# EAGLE schematic knappekrets (EAGLE 9.6.2)
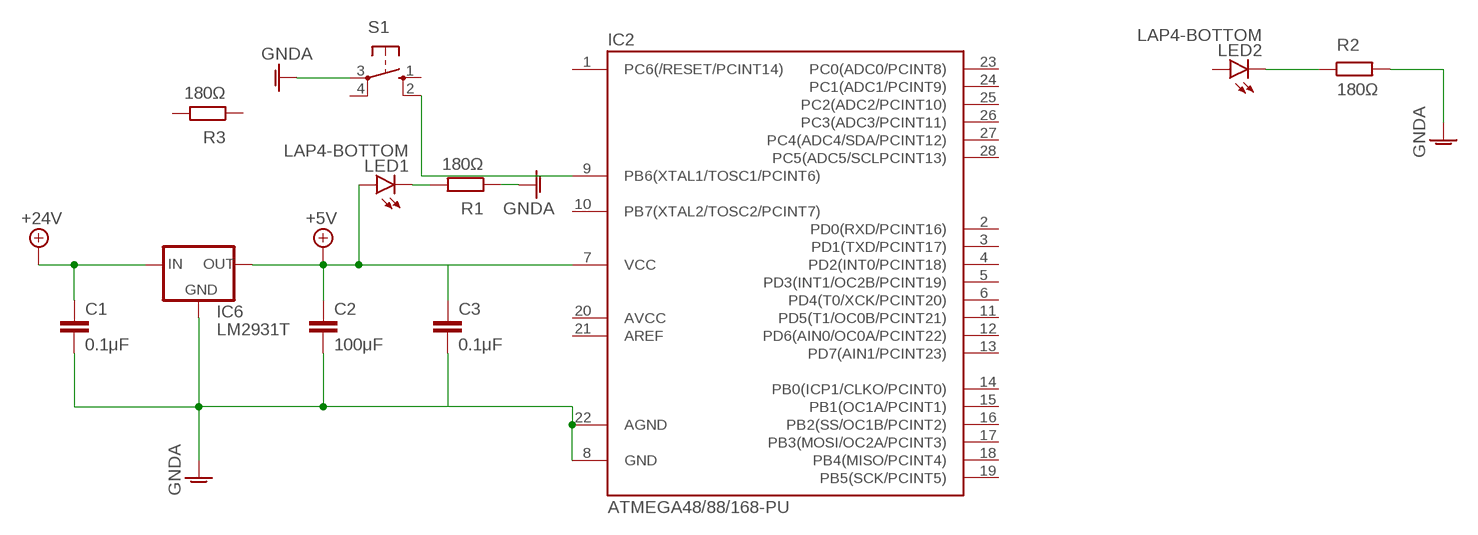
[diagram p0: schematic, sheet 1]

## Parts
C1  0.1μF  C2,5-3  [C2.5-3]
C2  100μF  C2,5-3  [C2.5-3]
C3  0.1μF  C2,5-3  [C2.5-3]
IC2  ATMEGA48/88/168-PU  [DIL28-3]
IC6  LM2931T  [TO220S]
LED1  LAP4-BOTTOM  [P47F-BOTTOM]
LED2  LAP4-BOTTOM  [P47F-BOTTOM]
R1  180Ω  R  (no package)
R2  180Ω  R  (no package)
R3  180Ω  R  (no package)
S1  10-XX  [B3F-10XX]

## Nets
+5V1: C3.1
+24V: C1.1 C2.1 IC2.7(VCC) IC6.1(IN) IC6.3(OUT) LED1.A ; supply symbol labelled +5V
GNDA: C1.2 C2.2 IC2.8(GND) IC2.22(AGND) IC6.2(GND) R1.1 R2.2 S1.3(P)
GNDA1: C3.2
N$1: LED1.C R1.2
N$2: IC2.9(PB6(XTAL1/TOSC1/PCINT6)) S1.2(S1)
N$4: LED2.C R2.1
Unconnected: IC2.1(PC6(/RESET/PCINT14)) IC2.2(PD0(RXD/PCINT16)) IC2.3(PD1(TXD/PCINT17)) IC2.4(PD2(INT0/PCINT18)) IC2.5(PD3(INT1/OC2B/PCINT19)) IC2.6(PD4(T0/XCK/PCINT20)) IC2.10(PB7(XTAL2/TOSC2/PCINT7)) IC2.11(PD5(T1/OC0B/PCINT21)) IC2.12(PD6(AIN0/OC0A/PCINT22)) IC2.13(PD7(AIN1/PCINT23)) IC2.14(PB0(ICP1/CLKO/PCINT0)) IC2.15(PB1(OC1A/PCINT1)) IC2.16(PB2(SS/OC1B/PCINT2)) IC2.17(PB3(MOSI/OC2A/PCINT3)) IC2.18(PB4(MISO/PCINT4)) IC2.19(PB5(SCK/PCINT5)) IC2.20(AVCC) IC2.21(AREF) IC2.23(PC0(ADC0/PCINT8)) IC2.24(PC1(ADC1/PCINT9)) IC2.25(PC2(ADC2/PCINT10)) IC2.26(PC3(ADC3/PCINT11)) IC2.27(PC4(ADC4/SDA/PCINT12)) IC2.28(PC5(ADC5/SCLPCINT13)) LED2.A R3.1 R3.2 S1.1(S) S1.4(P1)

## Library data of the parts
C1-C3 = capacitor-wima:C: CAPACITOR naming: grid - package width
IC2 = atmega8:ATMEGA48/88/168-PU
IC6 = v-reg-3:LM2931: National Semiconductor <http://www.national.com> Low Dropout Fixed Regulator Vin up to 26V, Reverse Batterie/Load Dump/Short Circuit/Overload Protection,
LED1 LED2 = led:*P4: PointLED® Enhanced Thinfilm LED TOP & BOTTOM mount LS P47F, LR P47F, LA P47F, LY P47F, LT P4SG, LB P4SG, LW P4SG Source: http://catalog.osram-os.com .. LA_LR_LS_LY_P47F_Pb_free.pdf
R1-R3 = ngspice-simulation:R: RESISTOR
S1 = switch-omron:10-XX: OMRON SWITCH; MPN: B3F-1000; OC_FARNELL: 176432; OC_NEWARK: 36M3542